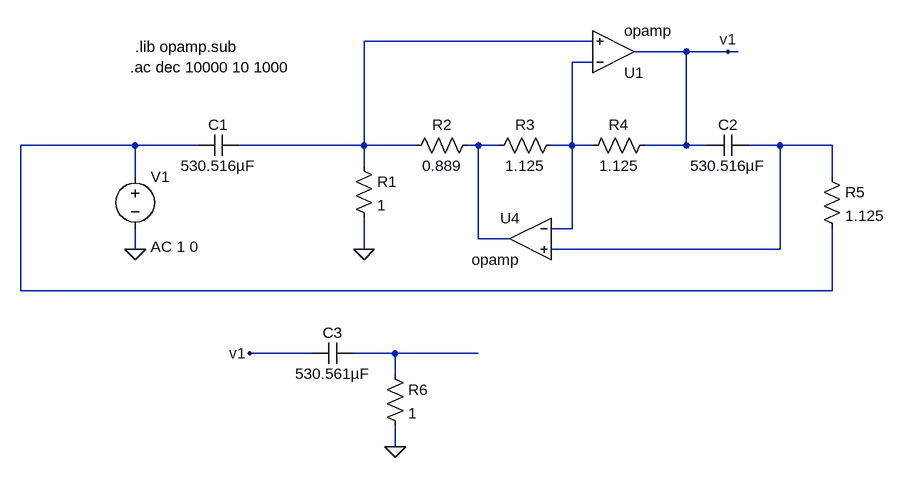
[diagram p0: schematic circuit.asc]
circuit.asc, the LTspice schematic file:
Version 4
SHEET 1 1196 1108
WIRE 672 -80 320 -80
WIRE 816 -64 736 -64
WIRE 880 -64 816 -64
WIRE 896 -64 880 -64
WIRE 672 -48 640 -48
WIRE -32 80 -208 80
WIRE 64 80 -32 80
WIRE 320 80 320 -80
WIRE 320 80 128 80
WIRE 400 80 320 80
WIRE 496 80 480 80
WIRE 528 80 496 80
WIRE 640 80 640 -48
WIRE 640 80 608 80
WIRE 672 80 640 80
WIRE 816 80 816 -64
WIRE 816 80 752 80
WIRE 848 80 816 80
WIRE 960 80 912 80
WIRE 1040 80 960 80
WIRE 320 112 320 80
WIRE -32 128 -32 80
WIRE 1040 128 1040 80
WIRE 640 208 640 80
WIRE 640 208 608 208
WIRE 496 224 496 80
WIRE 544 224 496 224
WIRE -32 240 -32 208
WIRE 320 240 320 192
WIRE 960 240 960 80
WIRE 960 240 608 240
WIRE -208 304 -208 80
WIRE 1040 304 1040 208
WIRE 1040 304 -208 304
WIRE 240 400 144 400
WIRE 368 400 304 400
WIRE 496 400 368 400
WIRE 368 432 368 400
WIRE 368 544 368 512
FLAG -32 240 0
FLAG 320 240 0
FLAG 880 -64 v1
FLAG 144 400 v1
FLAG 368 544 0
SYMBOL res 496 64 R90
WINDOW 0 0 56 VBottom 2
WINDOW 3 32 56 VTop 2
SYMATTR InstName R2
SYMATTR Value 0.889
SYMBOL res 768 64 R90
WINDOW 0 0 56 VBottom 2
WINDOW 3 32 56 VTop 2
SYMATTR InstName R4
SYMATTR Value 1.125
SYMBOL OpAmps\\opamp 704 0 M180
SYMATTR InstName U1
SYMBOL OpAmps\\opamp 576 160 M0
SYMATTR InstName U4
SYMBOL res 1024 112 R0
SYMATTR InstName R5
SYMATTR Value 1.125
SYMBOL voltage -32 112 R0
WINDOW 123 24 124 Left 2
WINDOW 39 0 0 Left 0
SYMATTR Value2 AC 1 0
SYMATTR InstName V1
SYMATTR Value ""
SYMBOL cap 912 64 R90
WINDOW 0 0 32 VBottom 2
WINDOW 3 32 32 VTop 2
SYMATTR InstName C2
SYMATTR Value 530.516µF
SYMBOL res 624 64 R90
WINDOW 0 0 56 VBottom 2
WINDOW 3 32 56 VTop 2
SYMATTR InstName R3
SYMATTR Value 1.125
SYMBOL cap 128 64 R90
WINDOW 0 0 32 VBottom 2
WINDOW 3 32 32 VTop 2
SYMATTR InstName C1
SYMATTR Value 530.516µF
SYMBOL res 304 96 R0
SYMATTR InstName R1
SYMATTR Value 1
SYMBOL res 352 416 R0
SYMATTR InstName R6
SYMATTR Value 1
SYMBOL cap 304 384 R90
WINDOW 0 0 32 VBottom 2
WINDOW 3 32 32 VTop 2
SYMATTR InstName C3
SYMATTR Value 530.561µF
TEXT -40 -40 Left 2 !.ac dec 10000 10 1000
TEXT -32 -72 Left 2 !.lib opamp.sub

The netlist it stands for:
* circuit.asc
R2 N004 N001 0.889
R4 v1 N002 1.125
XU1 N002 N001 v1 opamp Aol=100K GBW=10Meg  ; pins invin noninvin out
XU4 N002 N005 N004 opamp Aol=100K GBW=10Meg  ; pins invin noninvin out
R5 N005 N003 1.125
V1 N003 0 AC 1 0
C2 N005 v1 530.516µF
R3 N002 N004 1.125
C1 N001 N003 530.516µF
R1 N001 0 1
R6 N006 0 1
C3 N006 v1 530.561µF
.ac dec 10000 10 1000
.lib opamp.sub
.backanno
.end